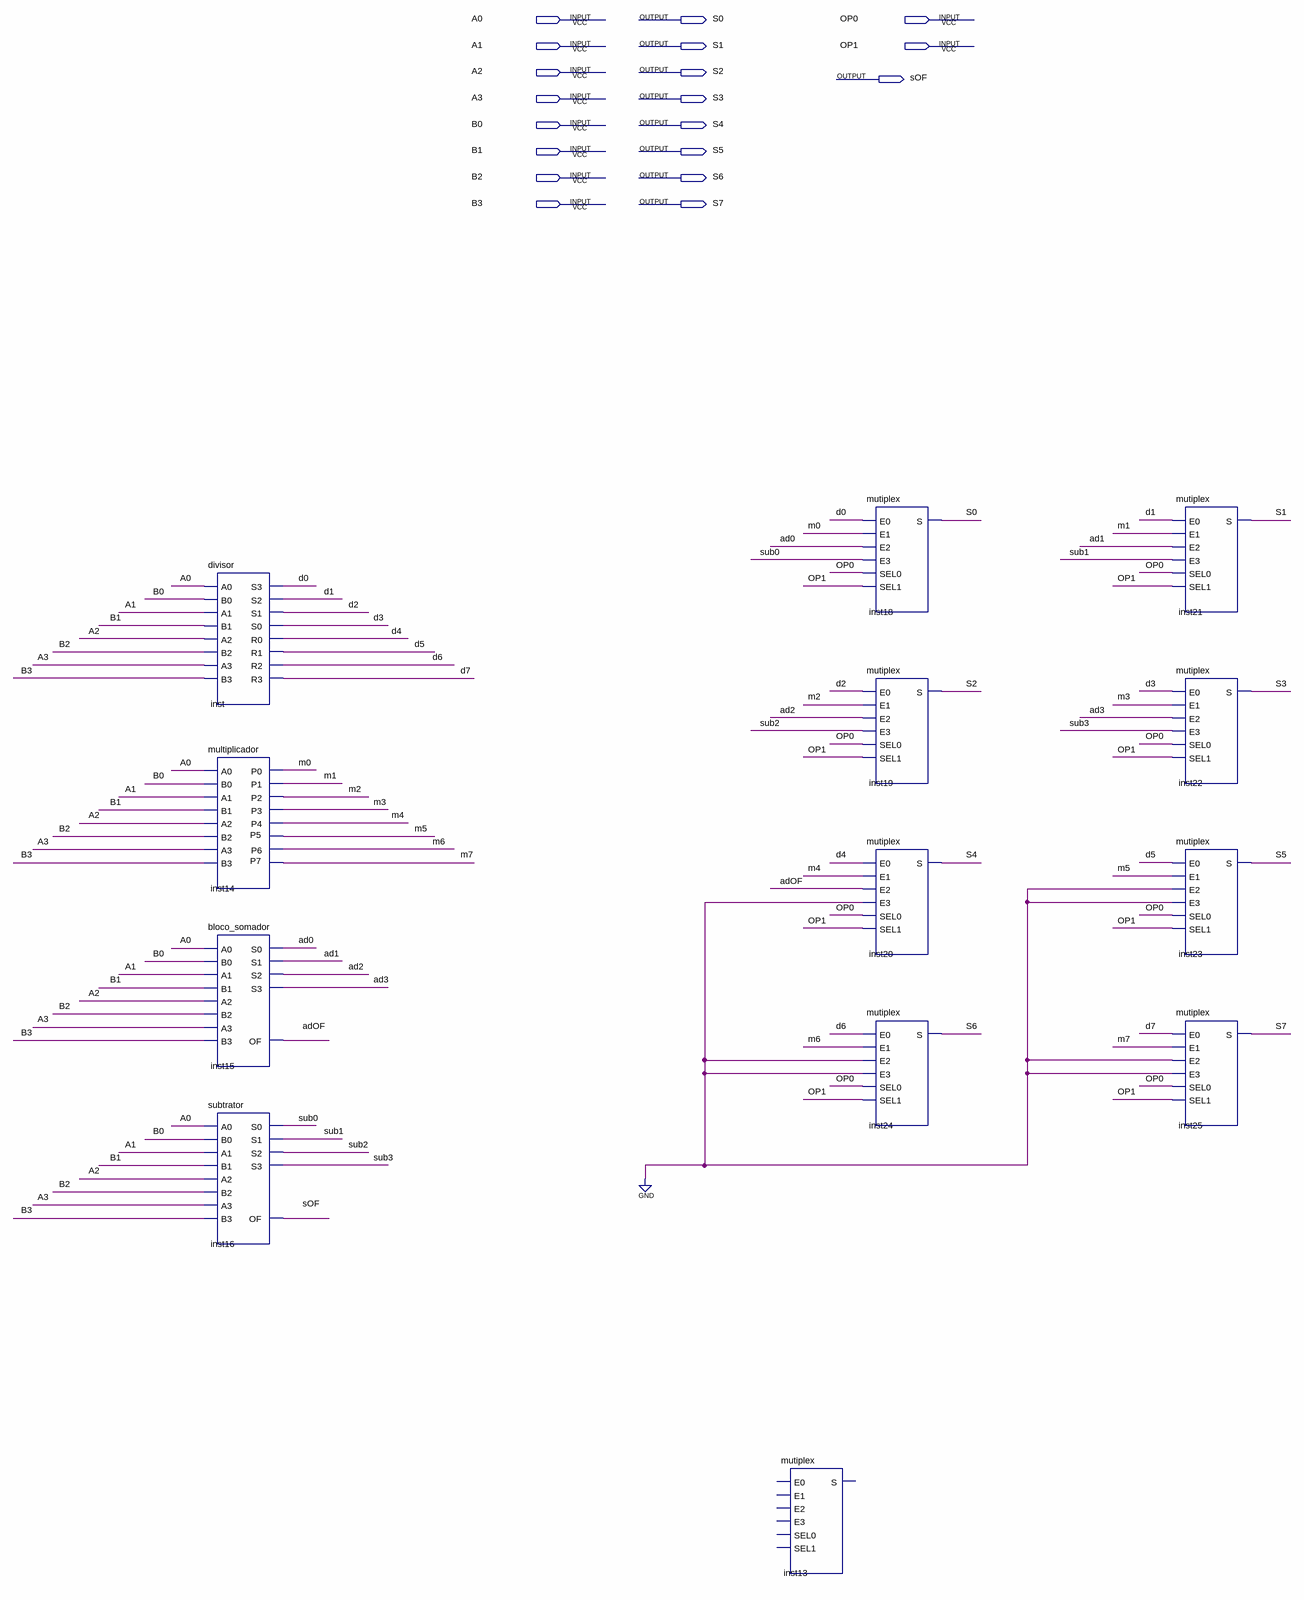
[diagram p0: schematic sheet]
// Quartus schematic calculadora.bdf as structural Verilog: 13 symbols, 19 pins
module calculadora (
  input  A0,
  input  OP0,
  input  A1,
  input  OP1,
  input  A2,
  input  A3,
  input  B0,
  input  B1,
  input  B2,
  input  B3,
  output S0,
  output S1,
  output S2,
  output sOF,
  output S3,
  output S4,
  output S5,
  output S6,
  output S7
);

  wire ad0, ad1, ad2, ad3, adOF, d0, d1, d2, d3, d4, d5, d6, d7, m0, m1, m2, m3, m4, m5, m6, m7, sub0, sub1,
       sub2, sub3;

  divisor inst (
    .A0(A0), .B0(B0), .A1(A1), .B1(B1), .A2(A2), .B2(B2), .A3(A3), .B3(B3), .S3(d0), .S2(d1), .S1(d2),
    .S0(d3), .R0(d4), .R1(d5), .R2(d6), .R3(d7));
  multiplicador inst14 (
    .A0(A0), .B0(B0), .A1(A1), .B1(B1), .A2(A2), .B2(B2), .A3(A3), .B3(B3), .P0(m0), .P4(m4), .P1(m1),
    .P5(m5), .P2(m2), .P6(m6), .P3(m3), .P7(m7));
  bloco_somador inst15 (
    .A0(A0), .B0(B0), .A1(A1), .B1(B1), .A2(A2), .B2(B2), .A3(A3), .B3(B3), .S0(ad0), .OF(adOF), .S1(ad1),
    .S2(ad2), .S3(ad3));
  subtrator inst16 (
    .A0(A0), .B0(B0), .A1(A1), .B1(B1), .A2(A2), .B2(B2), .A3(A3), .B3(B3), .S0(sub0), .OF(sOF), .S1(sub1),
    .S2(sub2), .S3(sub3));
  mutiplex inst13 ();  // open: E0, E1, E2, E3, SEL0, SEL1, S
  mutiplex inst18 (.E0(d0), .E1(m0), .E2(ad0), .E3(sub0), .SEL0(OP0), .SEL1(OP1), .S(S0));
  mutiplex inst19 (.E0(d2), .E1(m2), .E2(ad2), .E3(sub2), .SEL0(OP0), .SEL1(OP1), .S(S2));
  mutiplex inst20 (.E0(d4), .E1(m4), .E2(adOF), .E3(1'b0), .SEL0(OP0), .SEL1(OP1), .S(S4));
  mutiplex inst24 (.E0(d6), .E1(m6), .E2(1'b0), .E3(1'b0), .SEL0(OP0), .SEL1(OP1), .S(S6));
  mutiplex inst21 (.E0(d1), .E1(m1), .E2(ad1), .E3(sub1), .SEL0(OP0), .SEL1(OP1), .S(S1));
  mutiplex inst22 (.E0(d3), .E1(m3), .E2(ad3), .E3(sub3), .SEL0(OP0), .SEL1(OP1), .S(S3));
  mutiplex inst23 (.E0(d5), .E1(m5), .E2(1'b0), .E3(1'b0), .SEL0(OP0), .SEL1(OP1), .S(S5));
  mutiplex inst25 (.E0(d7), .E1(m7), .E2(1'b0), .E3(1'b0), .SEL0(OP0), .SEL1(OP1), .S(S7));
endmodule
